# Altium schematic sheet LTE.SchDoc: LTE (XB3-C-A1-UT) circuit
size A4; Author: Tim Chien; Revision: 1-1; SheetNumber: 6; SheetTotal: 6
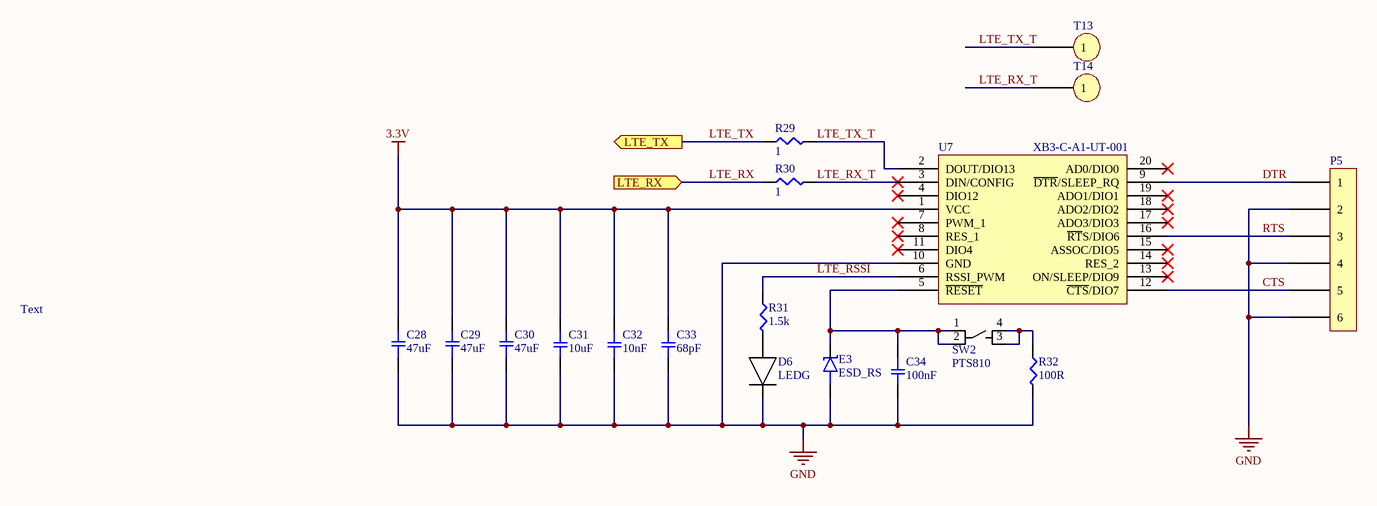
[diagram p0: LTE.SchDoc]

## Parts
C28  47uF  [0805-CAP]
C29  47uF  [0805-CAP]
C30  47uF  [0805-CAP]
C31  value 10uF  [0603-CAP]  (hidden comment: 0603C 10UF)
C32  value 10nF  [0603-CAP]  (hidden comment: 0603C 10NF)
C33  value 68pF  [0603-CAP]  (hidden comment: 0603C 68PF)
C34  value 100nF  [0603-CAP]  (hidden comment: 0603C 100NF)
D6  LEDG  [0603-LED]
E3  ESD_RS  [ESD_RS]
P5  6pins_connector  [6_PINS_2.54]  (value not drawn)
R29  value 1  [0603-RES]  (hidden comment: 0603R 1R)
R30  value 1  [0603-RES]  (hidden comment: 0603R 1R)
R31  value 1.5k  [0603-RES]  (hidden comment: 0603R 1K5R)
R32  value 100R  [0603-RES]  (hidden comment: 0603R 100R)
SW2  PTS810  [*SW_PTS810_SJM_250_SMTR_LFS]
T13  *  [1_PIN_test]  (value not drawn)
T14  *  [1_PIN_test]  (value not drawn)
U7  XB3-C-A1-UT-001  [XB24CAPIT-001]

## Ports
LTE_RX (in), LTE_TX (out)

## Nets
3.3V: C28.2 C29.2 C30.2 C31.1 C32.1 C33.1 U7.1(VCC)
GND: C28.1 C29.1 C30.1 C31.2 C32.2 C33.2 C34.2 D6.2 E3.2 P5.2 P5.4 P5.6 R32.2 U7.10(GND)
CTS: P5.5 U7.12(~{CTS}/DIO7)
DTR: P5.1 U7.9(~{DTR}/SLEEP_RQ)
LTE_RSSI: R31.1 U7.6(RSSI_PWM)
LTE_RX: R30.1 ; port LTE_RX
LTE_RX_T: R30.2 T14.1 U7.3(DIN/CONFIG)
LTE_TX: R29.1 ; port LTE_TX
LTE_TX_T: R29.2 T13.1 U7.2(DOUT/DIO13)
RTS: P5.3 U7.16(~{RT}S/DIO6)
NetC34_1: C34.1 E3.1 SW2.1 SW2.2 U7.5(~{RESET})
NetD6_1: D6.1 R31.2
NetR32_1: R32.1 SW2.3 SW2.4

Not connected (* = marked no-connect by the designer): U7 4(DIO12)* 7(PWM_1)* 8(RES_1)* 11(DIO4)* 13(ON/SLEEP/DIO9)* 14(RES_2)* 15(ASSOC/DIO5)* 17(ADO3/DIO3)* 18(ADO2/DIO2)* 19(ADO1/DIO1)* 20(AD0/DIO0)*

## Notes on the sheet
- Text
- Title
- Size:
- Date:
- A4
- Number:
- Time:
- Revision:
- Sheet
- of
- File:

## Library data of the parts
C28-C30 = 0805C 47UF: Supplier 1: Digi-Key; Supplier Part Number 1: 490-9949-1-ND; Value: 47uF
D6 = 0603 LEDG: Supplier 1: Digi-Key; Supplier Part Number 1: 160-1183-6-ND; Value: LEDG
E3 = ESD_RESET: Supplier 1: Digi-Key; Supplier Part Number 1: F7701CT-ND
SW2 = PTS810_SJM_250_SMTR_LFS: Tactile Switch SPST-NO Top Actuated Surface Mount; MP: PTS810 SJM 250 SMTR LFS; MF: C&K; Availability: Unavailable; Package: None; Price: 0.3; SnapEDA_Link: https://www.snapeda.com/parts/PTS810%20SJM%20250%20SMTR%20LFS/C%26K/view-part/522770/?ref=snap; Value: *; Digikey link: https://www.digikey.com/product-detail/en/c-k/PTS810-SJM-250-SMTR-LFS/CKN10502CT-ND/4176673; Digikey part number: CKN10502CT-ND
T13 T14 = 1pin_header
U7 = XB3-C-A1-UT-001: MF: Digi; Digikey link: https://www.digikey.com/product-detail/en/digi/XB3-C-A1-UT-001/602-2211-ND/8109033; Digikey part number: 602-2211-ND; MP: XB3-C-A1-UT-001; Package: 20-SMD Module; Price: 99; Datasheet link: https://www.digi.com/pdf/ds_xbee3-cellular-cat1.pdf
C31 = 0603C 10UF: Supplier 1: Digi-Key; Supplier Part Number 1: 490-10474-1-ND
C32 = 0603C 10NF: Supplier 1: Digi-Key; Supplier Part Number 1: 490-8028-1-ND
C33 = 0603C 68PF: Supplier 1: Digi-Key; Supplier Part Number 1: 311-4039-1-ND
C34 = 0603C 100NF: Supplier 1: Digi-Key; Supplier Part Number 1: 490-8020-1-ND
R29 R30 = 0603R 1R: Package: 0603; Supplier 1: Digi-Key; Supplier Part Number 1: 311-1.00HRCT-ND
R31 = 0603R 1K5R: Package: 0603; Supplier 1: Digi-Key; Supplier Part Number 1: 311-1.50KHRCT-ND
R32 = 0603R 100R: Package: 0603; Supplier 1: Digi-Key; Supplier Part Number 1: 311-100HRCT-ND